# EAGLE design M_J_ext_e_ink_disp (EAGLE 9.6.2)
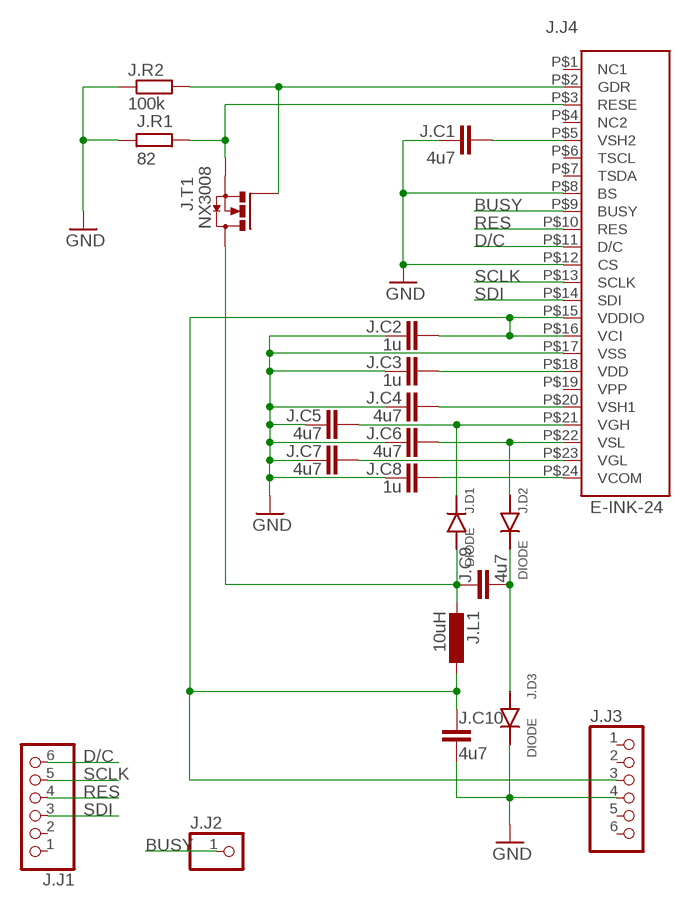
[diagram p0: schematic, sheet 1]

## Parts
J.C1  4u7  C-EUC0603  [C0603]
J.C2  1u  C-EUC0603  [C0603]
J.C3  1u  C-EUC0603  [C0603]
J.C4  4u7  C-EUC0603  [C0603]
J.C5  4u7  C-EUC0603  [C0603]
J.C6  4u7  C-EUC0603  [C0603]
J.C7  4u7  C-EUC0603  [C0603]
J.C8  1u  C-EUC0603  [C0603]
J.C9  4u7  C-EUC0603  [C0603]
J.C10  4u7  C-EUC0603  [C0603]
J.D1  DIODE  [DIODE]
J.D2  DIODE  [DIODE]
J.D3  DIODE  [DIODE]
J.J1  PINHD-1X6  [1X06]
J.J2  PINHD-1X1  [1X01]
J.J3  PINHD-1X6  [1X06]
J.J4  E-INK-24  [E-INK-24]
J.L1  10uH  L-EUL3230M  [L3230M]
J.R1  82  R-EU_R0603  [R0603]
J.R2  100k  R-EU_R0603  [R0603]
J.T1  NX3008  N-MOSFET  [SO23]

## Nets
BUSY: J.J2.1 J.J4.P$9(BUSY)
D/C: J.J1.6 J.J4.P$11(D/C)
GND: J.C1.2 J.C2.2 J.C3.2 J.C4.2 J.C5.2 J.C6.2 J.C7.2 J.C8.2 J.C10.2 J.D3.C J.J3.4 J.J4.P$8(BS) J.J4.P$12(CS) J.J4.P$17(VSS) J.R1.2 J.R2.1
N$1: J.C1.1 J.J4.P$5(VSH2)
N$2: J.C8.1 J.J4.P$24(VCOM)
N$3: J.C6.1 J.D2.A J.J4.P$22(VSL)
N$4: J.C5.1 J.D1.C J.J4.P$21(VGH)
N$5: J.C9.2 J.D2.C J.D3.A
N$6: J.J4.P$3(RESE) J.R1.1 J.T1.S
N$7: J.C3.1 J.J4.P$18(VDD)
N$8: J.C4.1 J.J4.P$20(VSH1)
N$9: J.C2.1 J.C10.1 J.J3.3 J.J4.P$15(VDDIO) J.J4.P$16(VCI) J.L1.1
N$10: J.C9.1 J.D1.A J.L1.2 J.T1.D
N$11: J.C7.1 J.J4.P$23(VGL)
N$13: J.J4.P$2(GDR) J.R2.2 J.T1.G
RES: J.J1.4 J.J4.P$10(RES)
SCLK: J.J1.5 J.J4.P$13(SCLK)
SDI: J.J1.3 J.J4.P$14(SDI)
Unconnected: J.J1.1 J.J1.2 J.J3.1 J.J3.2 J.J3.5 J.J3.6 J.J4.P$1(NC1) J.J4.P$4(NC2) J.J4.P$6(TSCL) J.J4.P$7(TSDA) J.J4.P$19(VPP)

## Library data of the parts
J.C1-J.C10 = rcl:C-EU: CAPACITOR, European symbol; SPICEPREFIX: C
J.D1-J.D3 = hugo:DIODE
J.J1 J.J3 = pinhead2:PINHD-1X6: PIN HEADER
J.J2 = pinhead2:PINHD-1X1: PIN HEADER
J.J4 = hugo:E-INK-24
J.L1 = rcl:L-EU: INDUCTOR, European symbol; SPICEPREFIX: L
J.R1 = resistor:R-EU_: RESISTOR, European symbol
J.R2 = rcl:R-EU_: RESISTOR, European symbol; SPICEPREFIX: R
J.T1 = hugo:N-MOSFET

## Board
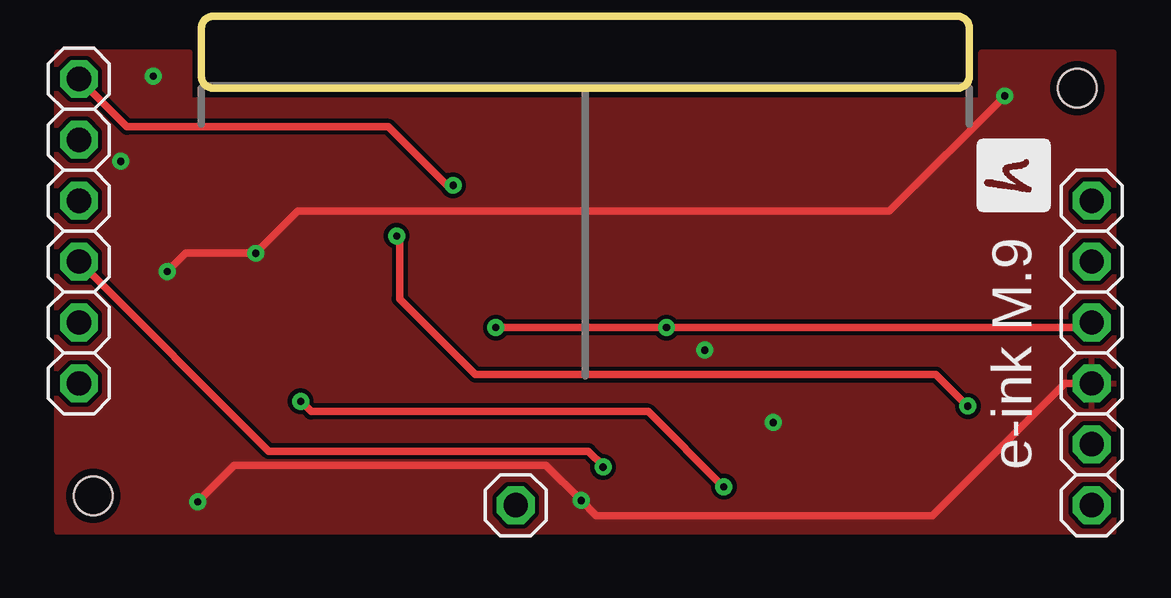
[diagram p1: board, top side]
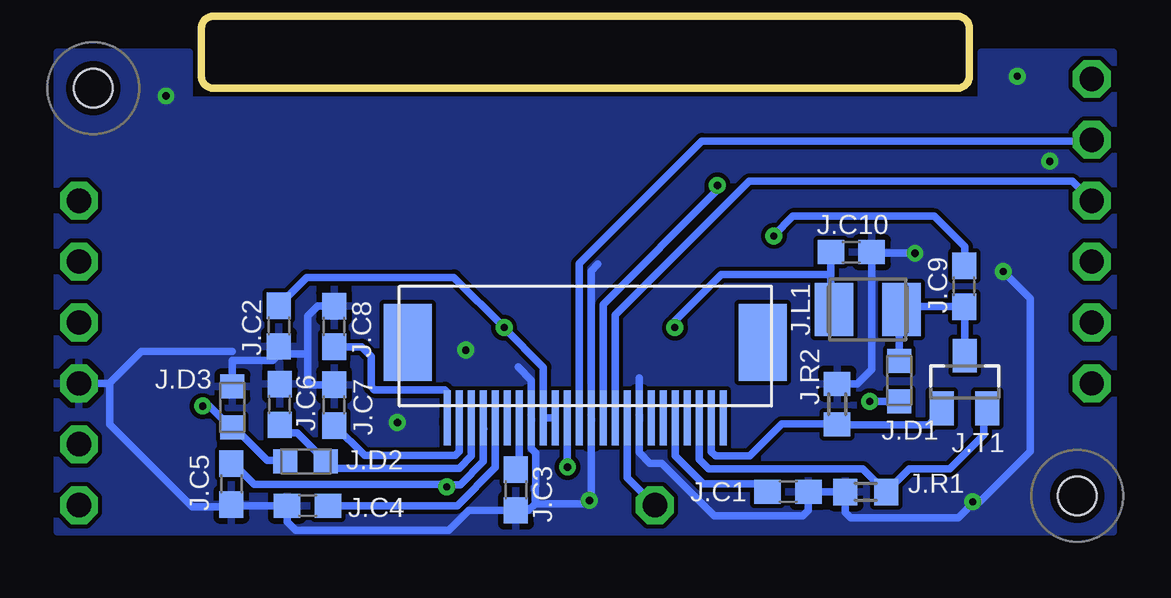
[diagram p2: board, bottom side, seen from below]

No outline drawn. Coordinates in mm, seen from the top.
Copper layers (1*16): Top 0.035mm / dielectric 1.5mm / Bottom 0.035mm
Design rules "default *": minimum track width 10mil, minimum drill 0.35mm, track to track 7mil, track to pad 7mil, pad to pad 7mil, via to via 10mil, smd to smd 10mil, copper to edge 10mil, drill to drill 15mil, minimum pad ring 10mil, minimum via ring 8mil, stop-mask expansion 4mil, vias tented up to drill 0mil, thermal gap 10mil
Holes 1.6 mm at 2,2 43,19
tRestrict: area 42,18 to 44,20; area 1,1 to 3,3
bRestrict: area 1,1 to 3,3; area 42,18 to 44,20
Milling: 8 lines

### Footprints (pad centres in the part's own frame; a part is rotated, then mirrored left to right if it is on the bottom)
C0603 = smd 1.1 x 1: 1 -0.85,0; 2 0.85,0
DIODE = smd 1 x 1: A 0.85,0; C -0.85,0
1X06 = drill 1.016 pad 1.575 octagon: 1 -6.35,0; 2 -3.81,0; 3 -1.27,0; 4 1.27,0; 5 3.81,0; 6 6.35,0
1X01 = drill 1.016 pad 1.575 octagon: 1 0,0
E-INK-24 = smd 0.3 x 2.3: P$1 -5.75,3.25; P$2 -5.25,3.25; P$3 -4.75,3.25; P$4 -4.25,3.25; P$5 -3.75,3.25; P$6 -3.25,3.25; P$7 -2.75,3.25; P$8 -2.25,3.25; P$9 -1.75,3.25; P$10 -1.25,3.25; P$11 -0.75,3.25; P$12 -0.25,3.25; P$13 0.25,3.25; P$14 0.75,3.25; P$15 1.25,3.25; P$16 1.75,3.25; P$17 2.25,3.25; P$18 2.75,3.25; P$19 3.25,3.25; P$20 3.75,3.25; P$21 4.25,3.25; P$22 4.75,3.25; P$23 5.25,3.25; P$24 5.75,3.25 | smd 2 x 3.2: P$25 -7.4,0.1; P$26 7.4,0.1
L3230M = smd 1.6 x 2.2: 1 -1.4,0; 2 1.4,0
R0603 = smd 1 x 1.1: 1 -0.85,0; 2 0.85,0
SO23 = smd 1 x 1.4: D 0,1.1; G -0.95,-1.1; S 0.95,-1.1

### Placement (x,y rotation side)
J.C1  14.05,2.16 0 bottom
J.C2  35.27,9.08 270 bottom
J.C3  25.39,2.25 270 bottom
J.C4  34.07,1.59 180 bottom
J.C5  37.25,2.49 270 bottom
J.C6  35.23,5.81 90 bottom
J.C7  32.97,5.78 90 bottom
J.C8  32.96,9.06 90 bottom
J.C9  6.71,10.74 90 bottom
J.C10  11.42,12.16 0 bottom
J.D1  9.42,6.79 90 bottom
J.D2  34.16,3.44 0 bottom
J.D3  37.21,5.71 270 bottom
J.J1  1.4,13.04 90 top
J.J2  19.6,1.61 0 top
J.J3  43.6,7.96 270 top
J.J4  22.5,8.5 180 bottom
J.L1  10.73,9.77 0 bottom
J.R1  10.82,2.16 180 bottom
J.R2  12.01,5.82 270 bottom
J.T1  6.69,6.75 0 bottom

### Tracks (layer width: path | path; a pad name or v marks a point on that pad's centre or on a via)
BUSY
  Bottom 0.305: J.J4.P$9 20.75,2.76 J.J2.1
D/C  (via drill 0.3)
  Top 0.305: v16.99,14.95 16.74,14.95 14.3,17.39 3.4,17.39 J.J1.6
  Bottom 0.305: J.J4.P$11 21.75,9.99 16.99,14.74 v16.99,14.95
GND  (via drill 0.3)
  Top 0.305: v6.35,1.75 7.88,3.28 20.85,3.28 v22.33,1.8 22.96,1.17 36.95,1.17 42.47,6.69 J.J3.4 | 5.11,11.33 v5.08,11.35 5.84,12.12 v8.76,12.12 10.52,13.87 35.16,13.87 v39.97,18.68
  Bottom 0.305: 24.59,1.68 24.59,2.38 24.56,2.41 24.56,3.78 24.75,3.97 J.J4.P$17 24.75,6.82 25.3,7.37 | 24.59,1.68 24.87,1.4 J.C3.2 27.36,1.4 28.2,0.56 34.57,0.56 34.92,0.91 J.C4.2 | 34.94,1.57 J.C4.2 | J.J3.4 42.33,6.69 | 42.33,6.69 42.32,6.68 42.32,4.99 38.88,1.54 37.35,1.54 | v6.35,1.75 6.4,1.8 | v6.35,1.75 6.33,1.73 6.96,1.09 11.44,1.09 11.67,1.32 J.R1.2 J.C1.2 | v5.08,11.35 3.96,10.24 3.96,3.86 6.07,1.75 v6.35,1.75 | 24.59,1.68 22.45,1.68 22.25,1.88 J.J4.P$12 22.25,11.38 21.97,11.66 | 20.24,6.91 20.25,6.9 J.J4.P$8 20.26,4.74 20.26,3.81 19.81,3.36 19.32,3.36 17.12,1.17 13.43,1.17 13.2,1.4 J.C1.2 | J.C8.2 33.65,9.91 34.06,9.5 34.06,7.77 | 37.21,8.02 41,8.02 42.33,6.69 | J.C7.2 33.99,6.63 34.06,6.71 34.06,7.77 | 34.06,7.77 34.06,7.92 35.01,7.92 35.27,8.18 J.C2.2 35.27,7.9 35.52,7.64 37.21,7.64 J.D3.C | J.C4.2 37.12,1.59 37.17,1.54 37.35,1.54 | 37.35,1.54 J.C5.2 | v8.76,12.12 10.53,12.12 J.C10.2 10.57,7.28 11.17,6.67 J.R2.1 | J.C1.2 13.53,2.49
  other vias: 27.48,8.08 3.15,15.95 4.5,19.5 30.33,5.05
  pour Bottom: 0.5,20.5 6,20.5 6,18.5 39,18.5 39,20.5 44.5,20.5 44.5,0.5 0.5,0.5
  pour Top: 0.5,20.5 6,20.5 6,18.5 39,18.5 39,20.5 44.5,20.5 44.5,0.5 0.5,0.5
N$1
  Bottom 0.305: J.J4.P$5 18.75,3.66 17.58,2.49 15.23,2.49 J.C1.1
N$2
  Bottom 0.305: 28.25,4.95 J.J4.P$24 28.25,6.32 28.35,6.42 31.29,6.42 31.42,6.55 31.42,7.82 31.81,8.21 J.C8.1 32.96,8.04
N$3
  Bottom 0.305: J.J4.P$22 27.25,3.66 27.76,3.15 33.02,3.15 J.D2.A 34.5,4.63 34.9,4.63 J.C6.1
N$4  (via drill 0.3)
  Top 0.305: v10.64,5.94 11.07,5.51 25.12,5.51 28.25,2.38 v28.27,2.38
  Bottom 0.305: 26.73,4.79 26.75,4.81 J.J4.P$21 26.74,4.74 26.74,3.43 27.72,2.46 28.19,2.46 v28.27,2.38 28.37,2.48 36.3,2.48 37.01,3.19 37.09,3.19 J.C5.1 | J.D1.C v10.63,5.94 v10.64,5.94
N$5  (via drill 0.3)
  Top 0.305: v14.64,12.84 14.76,12.72 14.76,10.22 17.92,7.06 37.1,7.06 38.42,5.74 v38.44,5.74
  Bottom 0.305: 38.52,5.67 v38.44,5.74 38.16,5.74 37.28,4.86 J.D3.A 37.13,4.86 35.75,3.48 35.05,3.48 J.D2.C | v14.64,12.84 14.64,12.86 13.85,13.66 7.96,13.66 6.69,12.39 6.69,11.62 J.C9.2
N$6
  Bottom 0.305: J.J4.P$3 17.75,3.53 17.35,3.12 10.93,3.12 J.R1.1 9,3.13 7.31,3.13 5.9,4.54 5.9,5.49 J.T1.S | 5.54,6.13 5.7,5.97 5.42,5.97 J.T1.S | 5.74,5.42 J.T1.S | J.T1.S 5.74,5.49
N$7
  Bottom 0.305: J.J4.P$18 25.25,3.23 J.C3.1
N$8
  Bottom 0.305: J.C4.1 27.84,1.59 26.25,3.19 J.J4.P$20
N$9  (via drill 0.3)
  Top 0.305: J.J3.3 43.4,9.03 25.89,9.03 v25.88,9.02 v18.77,9.02
  Bottom 0.305: J.J4.P$15 J.J4.P$16 24.25,7.36 25.88,8.99 v25.88,9.02 27.97,11.11 34.1,11.11 35.27,9.95 J.C2.1 | v18.77,9.02 18.77,9.3 16.84,11.23 12.27,11.23 | J.L1.1 | 12.08,9.98 12.08,9.73 J.L1.1 | J.C10.1 12.27,11.23 | 12.27,11.23 12.27,9.92 J.L1.1
N$10
  Bottom 0.305: 9.23,9.67 9.36,9.67 9.42,9.61 J.D1.A 9.51,7.74 | 9.23,9.67 9.03,9.67 8.81,9.89 J.C9.1 6.69,9.87 J.T1.D | 9.23,9.67 J.L1.2 9.56,9.54
N$11
  Bottom 0.305: J.J4.P$23 27.75,3.84 27.91,3.68 31.7,3.68 32.95,4.93 J.C7.1
N$13
  Bottom 0.305: 7.89,5.4 J.T1.G | J.J4.P$2 17.25,3.84 17.07,3.66 15.65,3.66 14.3,5 12.04,5 J.R2.2 11.99,4.95 8.19,4.95 7.64,5.49 J.T1.G | 7.64,5.62 J.T1.G
RES
  Bottom 0.305: J.J1.4 2.21,15.12 15.66,15.12 21.25,9.54 J.J4.P$10
SCLK
  Bottom 0.305: J.J4.P$13 22.75,4.76 22.76,4.77 22.76,11.68 17.64,16.8 1.45,16.8 J.J1.5
SDI  (via drill 0.3)
  Top 0.305: v23.24,3.2 23.24,3.25 22.62,3.86 9.32,3.86 1.41,11.77 J.J1.3
  Bottom 0.305: J.J4.P$14 v23.25,3.21 v23.24,3.2

### Text on the board
tPlace: e-ink M.9